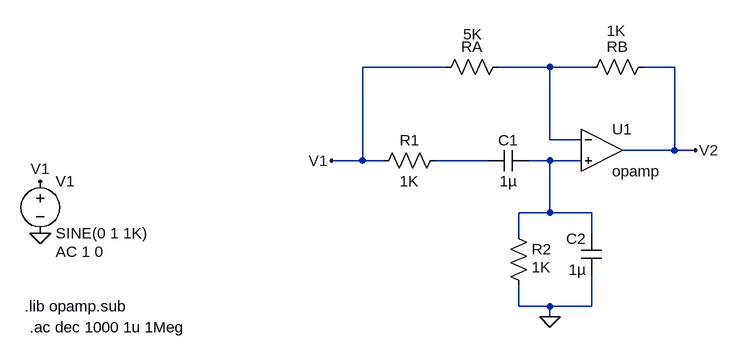
[diagram p0: schematic ejercicio7b_sin_normalizar.asc]
ejercicio7b_sin_normalizar.asc, the LTspice schematic file:
Version 4.1
SHEET 1 880 680
WIRE -16 32 -144 32
WIRE 144 32 64 32
WIRE 208 32 144 32
WIRE 336 32 288 32
WIRE 144 144 144 32
WIRE 192 144 144 144
WIRE 336 160 336 32
WIRE 336 160 256 160
WIRE 368 160 336 160
WIRE -144 176 -144 32
WIRE -144 176 -192 176
WIRE -112 176 -144 176
WIRE 48 176 -32 176
WIRE 144 176 112 176
WIRE 192 176 144 176
WIRE 144 256 144 176
WIRE 144 256 96 256
WIRE 208 256 144 256
WIRE 96 288 96 256
WIRE 208 288 208 256
WIRE 96 400 96 368
WIRE 144 400 96 400
WIRE 208 400 208 352
WIRE 208 400 144 400
WIRE 144 416 144 400
FLAG 144 416 0
FLAG -192 176 V1
FLAG 368 160 V2
FLAG -640 288 0
FLAG -640 208 V1
SYMBOL OpAmps\\opamp 224 96 R0
SYMATTR InstName U1
SYMBOL res 80 272 R0
WINDOW 3 36 68 Left 2
SYMATTR Value 1K
SYMATTR InstName R2
SYMBOL res -16 160 R90
WINDOW 0 0 56 VBottom 2
WINDOW 3 32 56 VTop 2
SYMATTR InstName R1
SYMATTR Value 1K
SYMBOL res 80 16 R90
WINDOW 0 0 56 VBottom 2
WINDOW 3 -19 55 VBottom 2
SYMATTR InstName RA
SYMATTR Value 5K
SYMBOL res 304 16 R90
WINDOW 0 0 56 VBottom 2
WINDOW 3 -24 58 VBottom 2
SYMATTR InstName RB
SYMATTR Value 1K
SYMBOL cap 112 160 R90
WINDOW 0 0 32 VBottom 2
WINDOW 3 32 32 VTop 2
SYMATTR InstName C1
SYMATTR Value 1µ
SYMBOL cap 224 352 R180
WINDOW 0 24 56 Left 2
WINDOW 3 24 8 Left 2
SYMATTR InstName C2
SYMATTR Value 1µ
SYMBOL voltage -640 192 R0
WINDOW 123 24 124 Left 2
WINDOW 39 0 0 Left 0
SYMATTR Value2 AC 1 0
SYMATTR InstName V1
SYMATTR Value SINE(0 1 1K)
TEXT -664 400 Left 2 !.lib opamp.sub
TEXT -656 432 Left 2 !.ac dec 1000 1u 1Meg

The netlist it stands for:
* ejercicio7b_sin_normalizar.asc
X§U1 N001 N003 V2 opamp Aol=100K GBW=10Meg  ; pins invin noninvin out
R2 N003 0 1K
R1 N002 V1 1K
RA N001 V1 5K
RB V2 N001 1K
C1 N003 N002 1µ
C2 0 N003 1µ
V1 V1 0 SINE(0 1 1K) AC 1 0
.lib opamp.sub
.ac dec 1000 1u 1Meg
.backanno
.end